# EasyEDA schematic SCH_USB_breakout_2021-07-08.json
TITLE: Sheet_1; REV: 1.0; Date: 2021-07-08; Sheet: 1/1; Drawn By: M Aitesam; Company: Your Company
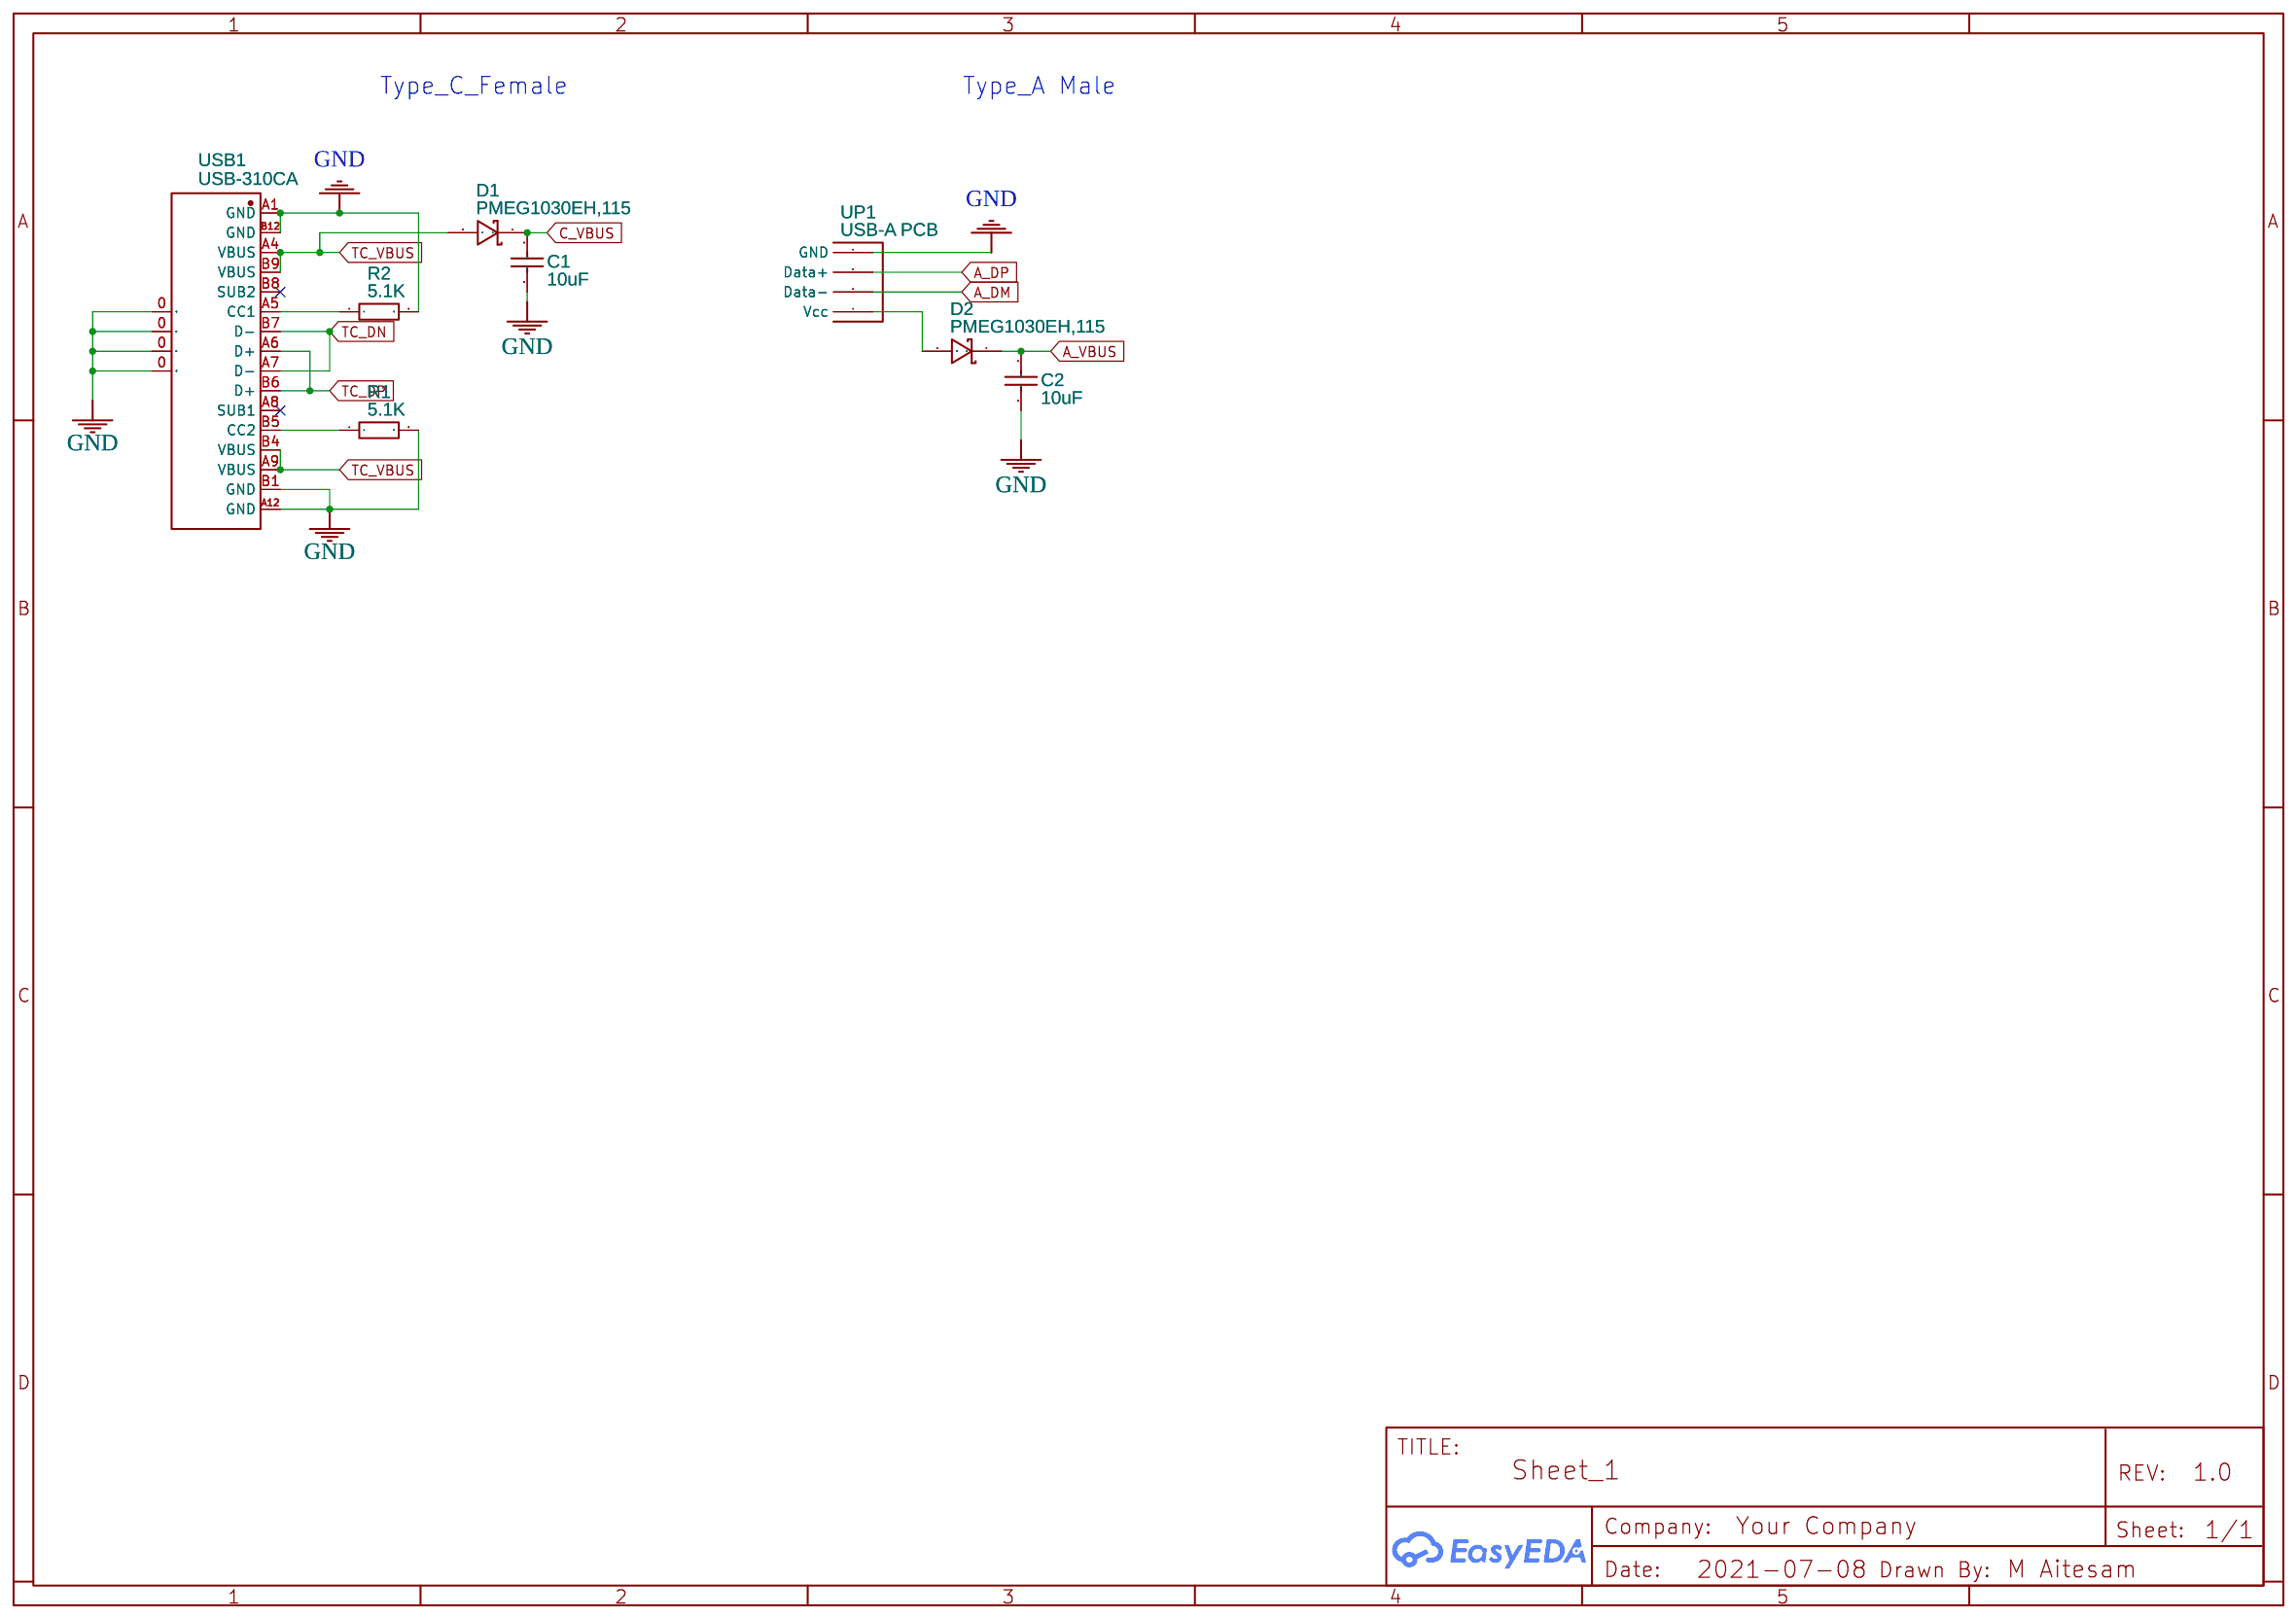
[diagram p0: schematic sheet]

## Parts
C1  10uF  [C0805]
C2  10uF  [C0805]
D1  PMEG1030EH,115  [SOD-123F_L2.8-W1.8-LS3.7-RD]
D2  PMEG1030EH,115  [SOD-123F_L2.8-W1.8-LS3.7-RD]
R1  5.1K  [R0603]
R2  5.1K  [R0603]
UP1  USB-A PCB  [USB-A PCB]
USB1  USB-310CA  [USB-C-SMD_20P-P0.50-L6.5-W11.2]

## Library data of the parts
C1 C2 = CL21A106KOQNNNE: Supplier: LCSC; Manufacturer: SAMSUNG; Supplier Part: C1713; JLCPCB Part Class: Extended Part
D1 D2 = PMEG1030EH,115: Supplier: LCSC; Supplier Part: C552800; Manufacturer: Nexperia; Contributor: LCSC
R1 R2 = RS-03K512JT: Supplier: LCSC; Manufacturer: FH; Supplier Part: C73801; JLCPCB Part Class: Extended Part
UP1 = USB-A PCB: Manufacturer Part: New SchematicLib; Contributor: Matti Vilska
USB1 = USB-310CA: Supplier: LCSC; Supplier Part: C309372; Manufacturer: HOOYA; Contributor: LCSC; JLCPCB Part Class: Extended Part

## Nets
GND: C1.1 C2.1 R1.2 R2.2 UP1.1(GND) USB1.0 USB1.A1(GND) USB1.A12(GND) USB1.B1(GND) USB1.B12(GND)
A_DM: UP1.3(Data-)
A_DP: UP1.2(Data+)
A_VBUS: C2.2 D2.1
C_VBUS: C1.2 D1.1
TC_DN: USB1.A7(D-) USB1.B7(D-)
TC_DP: USB1.A6(D+) USB1.B6(D+)
TC_VBUS: D1.2 USB1.A4(VBUS) USB1.A9(VBUS) USB1.B4(VBUS) USB1.B9(VBUS)
Net-(D2-2): D2.2 UP1.4(Vcc)
Net-(R1-1): R1.1 USB1.B5(CC2)
Net-(R2-1): R2.1 USB1.A5(CC1)

Not connected (* = marked no-connect by the designer): USB1 A8(SUB1)* B8(SUB2)*

## Notes on the sheet
- Type_C_Female
- Type_A Male
